# Altium schematic sheet 02_ZYNQ_POWER.SchDoc
size A4; SheetNumber: 3; SheetTotal: 11
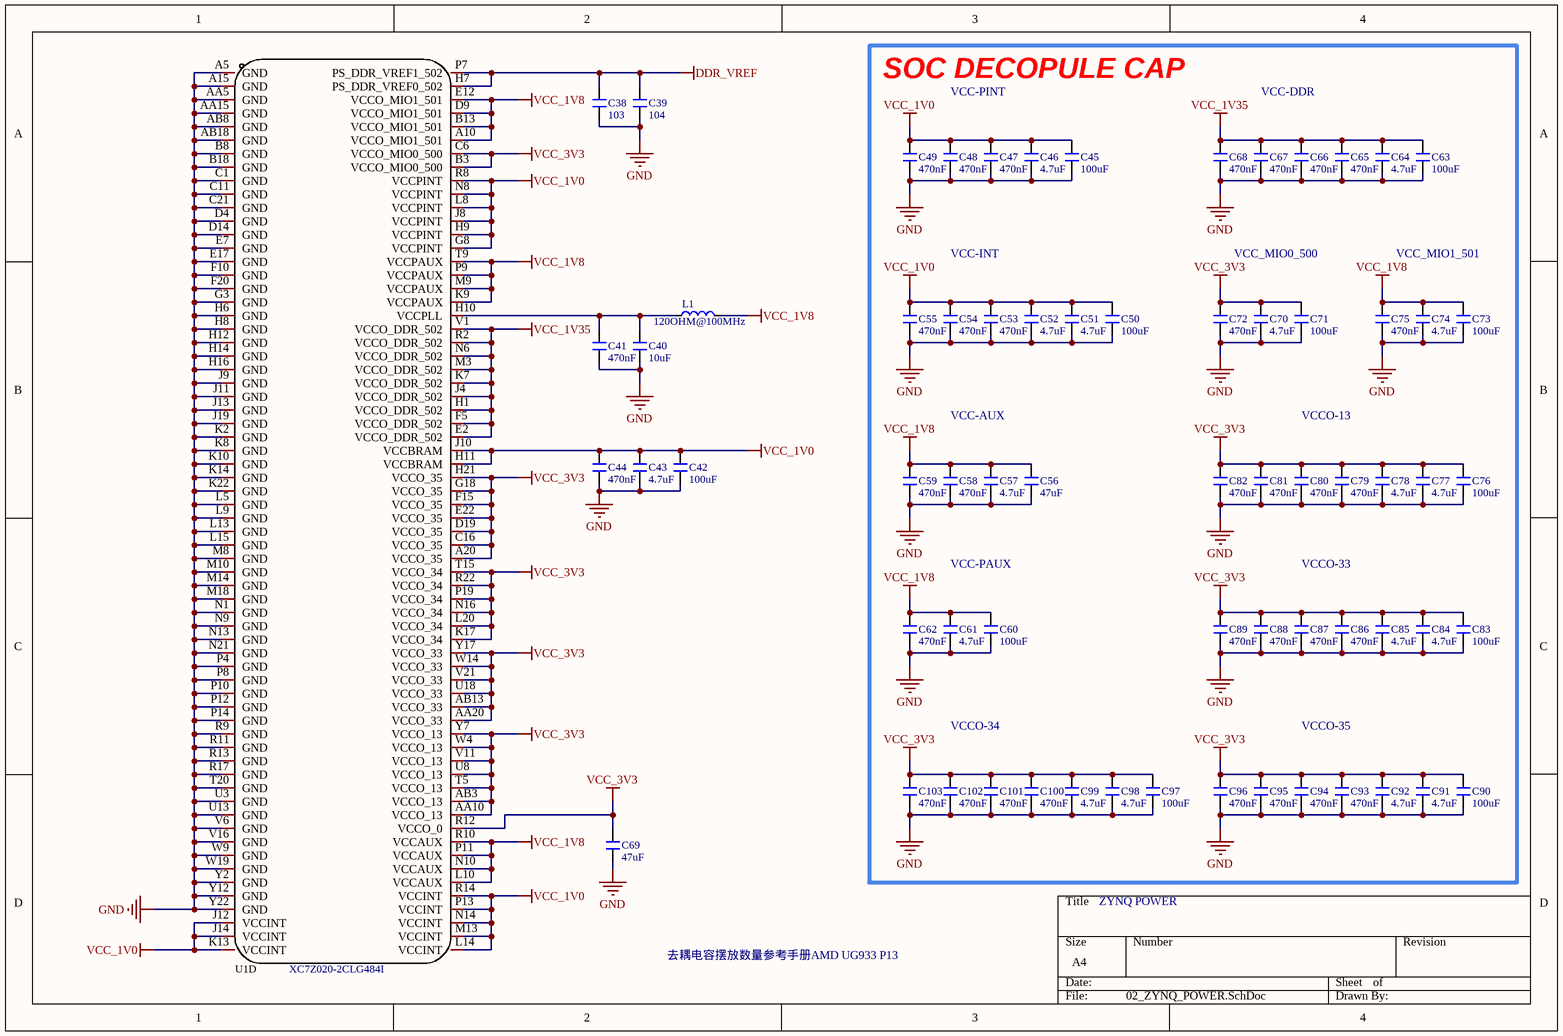
[diagram p0: 02_ZYNQ_POWER.SchDoc]

## Parts
C38  103  [C 0402]
C39  104  [C 0402]
C40  10uF  [C 0402]
C41  470nF  [C 0402]
C42  100uF  [C 0805]
C43  4.7uF  [C 0402]
C44  470nF  [C 0402]
C45  100uF  [C 0805]
C46  4.7uF  [C 0402]
C47  470nF  [C 0402]
C48  470nF  [C 0402]
C49  470nF  [C 0402]
C50  100uF  [C 0805]
C51  4.7uF  [C 0402]
C52  4.7uF  [C 0402]
C53  470nF  [C 0402]
C54  470nF  [C 0402]
C55  470nF  [C 0402]
C56  47uF  [C 0805]
C57  4.7uF  [C 0402]
C58  470nF  [C 0402]
C59  470nF  [C 0402]
C60  100uF  [C 0805]
C61  4.7uF  [C 0402]
C62  470nF  [C 0402]
C63  100uF  [C 0805]
C64  4.7uF  [C 0402]
C65  470nF  [C 0402]
C66  470nF  [C 0402]
C67  470nF  [C 0402]
C68  470nF  [C 0402]
C69  47uF  [C 0805]
C70  4.7uF  [C 0402]
C71  100uF  [C 0805]
C72  470nF  [C 0402]
C73  100uF  [C 0805]
C74  4.7uF  [C 0402]
C75  470nF  [C 0402]
C76  100uF  [C 0805]
C77  4.7uF  [C 0402]
C78  4.7uF  [C 0402]
C79  470nF  [C 0402]
C80  470nF  [C 0402]
C81  470nF  [C 0402]
C82  470nF  [C 0402]
C83  100uF  [C 0805]
C84  4.7uF  [C 0402]
C85  4.7uF  [C 0402]
C86  470nF  [C 0402]
C87  470nF  [C 0402]
C88  470nF  [C 0402]
C89  470nF  [C 0402]
C90  100uF  [C 0805]
C91  4.7uF  [C 0402]
C92  4.7uF  [C 0402]
C93  470nF  [C 0402]
C94  470nF  [C 0402]
C95  470nF  [C 0402]
C96  470nF  [C 0402]
C97  100uF  [C 0805]
C98  4.7uF  [C 0402]
C99  4.7uF  [C 0402]
C100  470nF  [C 0402]
C101  470nF  [C 0402]
C102  470nF  [C 0402]
C103  470nF  [C 0402]
L1  120OHM@100MHz  [L 0603]
U1  XC7Z020-2CLG484I  [FPBGA-484_L19.0-W19.0-R22-C22-P0.80-BL]  (part D of 4)

## Blocks framed on the sheet
SOC DECOPULE CAP: C45-C68 C70-C103

## Nets
DDR_VREF: C38.2 C39.2 U1.H7(PS_DDR_VREF0_502) U1.P7(PS_DDR_VREF1_502)
GND: C38.1 C39.1 C40.1 C41.1 C42.1 C43.1 C44.1 C45.1 C46.1 C47.1 C48.1 C49.1 C50.1 C51.1 C52.1 C53.1 C54.1 C55.1 C56.1 C57.1 C58.1 C59.1 C60.1 C61.1 C62.1 C63.1 C64.1 C65.1 C66.1 C67.1 C68.1 C69.1 C70.1 C71.1 C72.1 C73.1 C74.1 C75.1 C76.1 C77.1 C78.1 C79.1 C80.1 C81.1 C82.1 C83.1 C84.1 C85.1 C86.1 C87.1 C88.1 C89.1 C90.1 C91.1 C92.1 C93.1 C94.1 C95.1 C96.1 C97.1 C98.1 C99.1 C100.1 C101.1 C102.1 C103.1 U1.A5(GND) U1.A15(GND) U1.AA5(GND) U1.AA15(GND) U1.AB8(GND) U1.AB18(GND) U1.B8(GND) U1.B18(GND) U1.C1(GND) U1.C11(GND) U1.C21(GND) U1.D4(GND) U1.D14(GND) U1.E7(GND) U1.E17(GND) U1.F10(GND) U1.F20(GND) U1.G3(GND) U1.H6(GND) U1.H8(GND) U1.H12(GND) U1.H14(GND) U1.H16(GND) U1.J9(GND) U1.J11(GND) U1.J13(GND) U1.J19(GND) U1.K2(GND) U1.K8(GND) U1.K10(GND) U1.K14(GND) U1.K22(GND) U1.L5(GND) U1.L9(GND) U1.L13(GND) U1.L15(GND) U1.M8(GND) U1.M10(GND) U1.M14(GND) U1.M18(GND) U1.N1(GND) U1.N9(GND) U1.N13(GND) U1.N21(GND) U1.P4(GND) U1.P8(GND) U1.P10(GND) U1.P12(GND) U1.P14(GND) U1.R9(GND) U1.R11(GND) U1.R13(GND) U1.R17(GND) U1.T20(GND) U1.U3(GND) U1.U13(GND) U1.V6(GND) U1.V16(GND) U1.W9(GND) U1.W19(GND) U1.Y2(GND) U1.Y12(GND) U1.Y22(GND)
VCC_1V0: C42.2 C43.2 C44.2 C45.2 C46.2 C47.2 C48.2 C49.2 C50.2 C51.2 C52.2 C53.2 C54.2 C55.2 U1.G8(VCCPINT) U1.H9(VCCPINT) U1.H11(VCCBRAM) U1.J8(VCCPINT) U1.J10(VCCBRAM) U1.J12(VCCINT) U1.J14(VCCINT) U1.K13(VCCINT) U1.L8(VCCPINT) U1.L14(VCCINT) U1.M13(VCCINT) U1.N8(VCCPINT) U1.N14(VCCINT) U1.P13(VCCINT) U1.R8(VCCPINT) U1.R14(VCCINT)
VCC_1V8: C56.2 C57.2 C58.2 C59.2 C60.2 C61.2 C62.2 C73.2 C74.2 C75.2 L1.2 U1.A10(VCCO_MIO1_501) U1.B13(VCCO_MIO1_501) U1.D9(VCCO_MIO1_501) U1.E12(VCCO_MIO1_501) U1.K9(VCCPAUX) U1.L10(VCCAUX) U1.M9(VCCPAUX) U1.N10(VCCAUX) U1.P9(VCCPAUX) U1.P11(VCCAUX) U1.R10(VCCAUX) U1.T9(VCCPAUX)
VCC_1V35: C63.2 C64.2 C65.2 C66.2 C67.2 C68.2 U1.E2(VCCO_DDR_502) U1.F5(VCCO_DDR_502) U1.H1(VCCO_DDR_502) U1.J4(VCCO_DDR_502) U1.K7(VCCO_DDR_502) U1.M3(VCCO_DDR_502) U1.N6(VCCO_DDR_502) U1.R2(VCCO_DDR_502) U1.V1(VCCO_DDR_502)
VCC_3V3: C69.2 C70.2 C71.2 C72.2 C76.2 C77.2 C78.2 C79.2 C80.2 C81.2 C82.2 C83.2 C84.2 C85.2 C86.2 C87.2 C88.2 C89.2 C90.2 C91.2 C92.2 C93.2 C94.2 C95.2 C96.2 C97.2 C98.2 C99.2 C100.2 C101.2 C102.2 C103.2 U1.A20(VCCO_35) U1.AA10(VCCO_13) U1.AA20(VCCO_33) U1.AB3(VCCO_13) U1.AB13(VCCO_33) U1.B3(VCCO_MIO0_500) U1.C6(VCCO_MIO0_500) U1.C16(VCCO_35) U1.D19(VCCO_35) U1.E22(VCCO_35) U1.F15(VCCO_35) U1.G18(VCCO_35) U1.H21(VCCO_35) U1.K17(VCCO_34) U1.L20(VCCO_34) U1.N16(VCCO_34) U1.P19(VCCO_34) U1.R12(VCCO_0) U1.R22(VCCO_34) U1.T5(VCCO_13) U1.T15(VCCO_34) U1.U8(VCCO_13) U1.U18(VCCO_33) U1.V11(VCCO_13) U1.V21(VCCO_33) U1.W4(VCCO_13) U1.W14(VCCO_33) U1.Y7(VCCO_13) U1.Y17(VCCO_33)
NetC40_2: C40.2 C41.2 L1.1 U1.H10(VCCPLL)

## Notes on the sheet
- VCC-PINT
- VCC-DDR
- VCC-INT
- VCC_MIO0_500
- VCC_MIO1_501
- VCC-AUX
- VCCO-13
- VCC-PAUX
- VCCO-33
- VCCO-34
- VCCO-35
- ZYNQ POWER
- 去耦电容摆放数量参考手册AMD UG933 P13

## Library data of the parts
C38-C103 = C: 无极性贴片电容; 版权归属: 源创客; BOM名称: 无极性贴片电容; 学习资源: www.ooocke.com
L1 = L: 小功率贴片电感磁珠; 版权归属: 源创客; BOM名称: 小功率贴片电感; 学习资源: www.ooocke.com
U1 = XC7Z020-2CLG484I: Manufacturer: XILINX(赛灵思); Add into BOM: yes; Paste Type: expand; Name: XC7Z020-2CLG484I; Symbol: XC7Z020-2CLG484I; Device: XC7Z020-2CLG484I; LCSC Part Name: XC7Z020-2CLG484I; Supplier Part: C157624; Manufacturer Part: XC7Z020-2CLG484I; Supplier Footprint: CSPBGA-484; JLCPCB Part Class: Extended Part; Datasheet: https://atta.szlcsc.com/upload/public/pdf/source/20180115/C157624_15160149665121269420.pdf; Supplier: LCSC; Convert to PCB: yes; Assembly Type: smtWeld